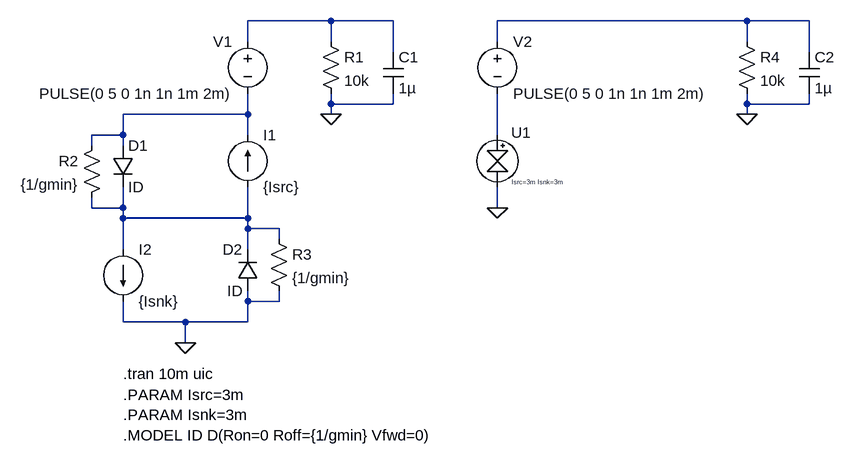
[diagram p0: schematic Iconst.asc]
Iconst.asc, the LTspice schematic file:
Version 4
SHEET 1 1652 740
WIRE 304 64 176 64
WIRE 400 64 304 64
WIRE 944 64 560 64
WIRE 1040 64 944 64
WIRE 176 96 176 64
WIRE 304 96 304 64
WIRE 560 96 560 64
WIRE 944 96 944 64
WIRE 400 112 400 64
WIRE 1040 112 1040 64
WIRE 304 192 304 176
WIRE 400 192 400 176
WIRE 400 192 304 192
WIRE 944 192 944 176
WIRE 1040 192 1040 176
WIRE 1040 192 944 192
WIRE 176 208 176 176
WIRE 176 208 -16 208
WIRE 304 208 304 192
WIRE 944 208 944 192
WIRE -16 240 -16 208
WIRE -16 240 -64 240
WIRE 176 240 176 208
WIRE 560 240 560 176
WIRE -64 256 -64 240
WIRE -16 256 -16 240
WIRE -64 352 -64 336
WIRE -16 352 -16 320
WIRE -16 352 -64 352
WIRE 560 352 560 320
WIRE -16 368 -16 352
WIRE 176 368 176 320
WIRE 176 368 -16 368
WIRE 176 384 176 368
WIRE 224 384 176 384
WIRE 224 400 224 384
WIRE -16 416 -16 368
WIRE 176 416 176 384
WIRE 176 496 176 480
WIRE 224 496 224 480
WIRE 224 496 176 496
WIRE -16 528 -16 496
WIRE 80 528 -16 528
WIRE 176 528 176 496
WIRE 176 528 80 528
WIRE 80 560 80 528
FLAG 80 560 0
FLAG 304 208 0
FLAG 944 208 0
FLAG 560 352 0
SYMBOL voltage 176 80 M0
SYMATTR InstName V1
SYMATTR Value PULSE(0 5 0 1n 1n 1m 2m)
SYMBOL current 176 320 M180
WINDOW 0 24 80 Left 2
WINDOW 3 24 0 Left 2
SYMATTR InstName I1
SYMATTR Value {Isrc}
SYMBOL current -16 416 R0
SYMATTR InstName I2
SYMATTR Value {Isnk}
SYMBOL diode -32 256 R0
SYMATTR InstName D1
SYMATTR Value ID
SYMBOL diode 192 480 R180
WINDOW 0 24 64 Left 2
WINDOW 3 24 0 Left 2
SYMATTR InstName D2
SYMATTR Value ID
SYMBOL res 288 80 R0
SYMATTR InstName R1
SYMATTR Value 10k
SYMBOL cap 384 112 R0
SYMATTR InstName C1
SYMATTR Value 1µ
SYMBOL res -48 240 M0
SYMATTR InstName R2
SYMATTR Value {1/gmin}
SYMBOL res 208 384 R0
SYMATTR InstName R3
SYMATTR Value {1/gmin}
SYMBOL voltage 560 80 R0
SYMATTR InstName V2
SYMATTR Value PULSE(0 5 0 1n 1n 1m 2m)
SYMBOL res 928 80 R0
SYMATTR InstName R4
SYMATTR Value 10k
SYMBOL cap 1024 112 R0
SYMATTR InstName C2
SYMATTR Value 1µ
SYMBOL Iconst 560 224 R0
SYMATTR InstName U1
SYMATTR Value2 Isrc=3m Isnk=3m
TEXT -16 640 Left 2 !.PARAM Isrc=3m\n.PARAM Isnk=3m\n.MODEL ID D(Ron=0 Roff={1/gmin} Vfwd=0)
TEXT -16 608 Left 2 !.tran 10m uic

The netlist it stands for:
* Iconst.asc
V1 N001 N003 PULSE(0 5 0 1n 1n 1m 2m)
I1 N005 N003 {Isrc}
I2 N005 0 {Isnk}
D1 N003 N005 ID
D2 0 N005 ID
R1 N001 0 10k
C1 N001 0 1µ
R2 N003 N005 {1/gmin}
R3 N005 0 {1/gmin}
V2 N002 N004 PULSE(0 5 0 1n 1n 1m 2m)
R4 N002 0 10k
C2 N002 0 1µ
XU1 N004 0 Iconst Isrc=3m Isnk=3m  ; pins 1 2
.model D D
.lib standard.dio
.PARAM Isrc=3m
.PARAM Isnk=3m
.MODEL ID D(Ron=0 Roff={1/gmin} Vfwd=0)
.tran 10m uic
.lib Iconst.lib
.backanno
.end